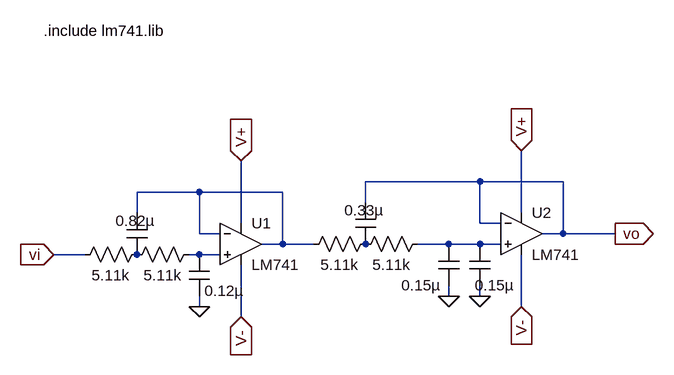
[diagram p0: schematic LPF.asc]
LPF.asc, the LTspice schematic file:
Version 4.1
SHEET 1 888 680
WIRE 592 272 416 272
WIRE 720 272 592 272
WIRE 160 288 64 288
WIRE 288 288 160 288
WIRE 416 304 416 272
WIRE 64 320 64 288
WIRE 656 320 656 224
WIRE 224 336 224 240
WIRE 592 336 592 272
WIRE 624 336 592 336
WIRE 160 352 160 288
WIRE 192 352 160 352
WIRE 720 352 720 272
WIRE 720 352 688 352
WIRE 800 352 720 352
WIRE 288 368 288 288
WIRE 288 368 256 368
WIRE 336 368 288 368
WIRE 544 368 496 368
WIRE 592 368 544 368
WIRE 624 368 592 368
WIRE -16 384 -64 384
WIRE 160 384 144 384
WIRE 192 384 160 384
WIRE 544 448 544 432
WIRE 592 448 592 432
WIRE 160 464 160 448
WIRE 656 464 656 384
WIRE 224 480 224 400
FLAG 160 464 0
FLAG 224 240 V+
IOPIN 224 240 In
FLAG 224 480 V-
IOPIN 224 480 In
FLAG -64 384 vi
IOPIN -64 384 In
FLAG 592 448 0
FLAG 656 224 V+
IOPIN 656 224 In
FLAG 656 464 V-
IOPIN 656 464 In
FLAG 544 448 0
FLAG 800 352 vo
IOPIN 800 352 Out
SYMBOL OpAmps\\opamp2 224 304 R0
SYMATTR InstName U1
SYMATTR Value LM741
SYMBOL res 80 368 R90
WINDOW 0 0 56 Invisible 2
WINDOW 3 32 56 VTop 2
SYMATTR InstName R1
SYMATTR Value 5.11k
SYMBOL res 48 400 R270
WINDOW 0 32 56 Invisible 2
WINDOW 3 0 56 VBottom 2
SYMATTR InstName R2
SYMATTR Value 5.11k
SYMBOL cap 144 384 R0
WINDOW 0 24 8 Invisible 2
SYMATTR InstName C1
SYMATTR Value 0.12µ
SYMBOL cap 48 320 R0
WINDOW 0 24 8 Invisible 2
WINDOW 3 -17 12 Left 2
SYMATTR InstName C2
SYMATTR Value 0.82µ
SYMBOL OpAmps\\opamp2 656 288 R0
SYMATTR InstName U2
SYMATTR Value LM741
SYMBOL res 432 352 R90
WINDOW 0 0 56 Invisible 2
WINDOW 3 32 56 VTop 2
SYMATTR InstName R3
SYMATTR Value 5.11k
SYMBOL res 400 384 R270
WINDOW 0 32 56 Invisible 2
WINDOW 3 0 56 VBottom 2
SYMATTR InstName R4
SYMATTR Value 5.11k
SYMBOL cap 576 368 R0
WINDOW 0 24 8 Invisible 2
WINDOW 3 8 63 Left 2
SYMATTR InstName C3
SYMATTR Value 0.15µ
SYMBOL cap 400 304 R0
WINDOW 0 24 8 Invisible 2
WINDOW 3 -17 12 Left 2
SYMATTR InstName C4
SYMATTR Value 0.33µ
SYMBOL cap 528 368 R0
WINDOW 0 24 8 Invisible 2
WINDOW 3 -57 63 Left 2
SYMATTR InstName C5
SYMATTR Value 0.15µ
TEXT -80 40 Left 2 !.include lm741.lib

The netlist it stands for:
* LPF.asc
X§U1 N003 N001 V+ V- N001 LM741  ; pins In+ In- V+ V- OUT
R1 P001 vi 5.11k
R2 P001 N003 5.11k
C1 N003 0 0.12µ
C2 N001 P001 0.82µ
X§U2 N002 vo V+ V- vo LM741  ; pins In+ In- V+ V- OUT
R3 P002 N001 5.11k
R4 P002 N002 5.11k
C3 N002 0 0.15µ
C4 vo P002 0.33µ
C5 N002 0 0.15µ
.include lm741.lib
.backanno
.end